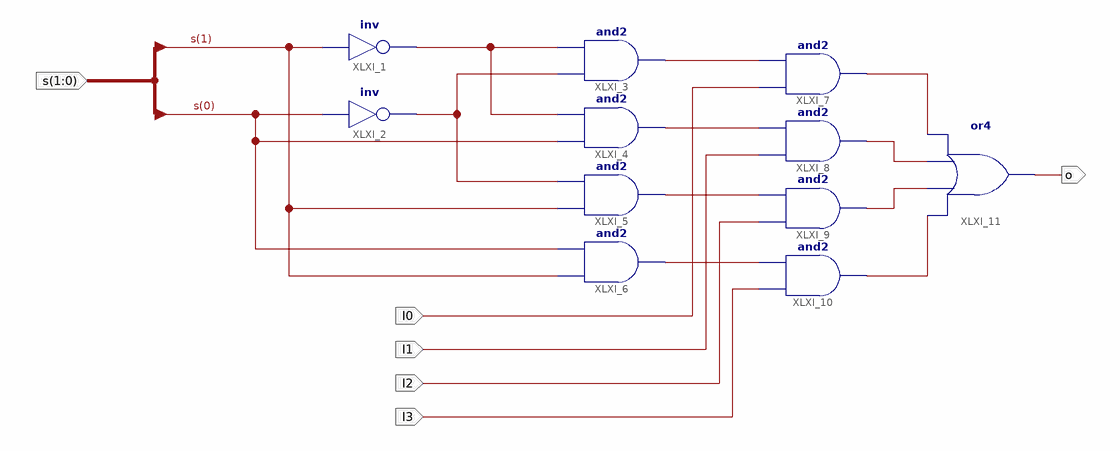
[diagram p0: schematic sheet 1]
// Xilinx ISE schematic Mux4to1.sch (kintex7) as structural Verilog: 11 symbols, 6 ports
module Mux4to1 (
  input  [1:0] s,
  input  I0,
  input  I1,
  input  I3,
  input  I2,
  output o
);

  wire XLXN_6, XLXN_7, XLXN_10, XLXN_11, XLXN_12, XLXN_13, XLXN_14, XLXN_15, XLXN_16, XLXN_17;

  not XLXI_1 (XLXN_6, s[1]);
  not XLXI_2 (XLXN_7, s[0]);
  and XLXI_3 (XLXN_10, XLXN_7, XLXN_6);
  and XLXI_4 (XLXN_11, s[0], XLXN_6);
  and XLXI_5 (XLXN_12, s[1], XLXN_7);
  and XLXI_6 (XLXN_13, s[1], s[0]);
  and XLXI_7 (XLXN_14, I0, XLXN_10);
  and XLXI_8 (XLXN_15, I1, XLXN_11);
  and XLXI_9 (XLXN_16, I2, XLXN_12);
  and XLXI_10 (XLXN_17, I3, XLXN_13);
  or XLXI_11 (o, XLXN_17, XLXN_16, XLXN_15, XLXN_14);
endmodule
